# EAGLE design Organ (EAGLE 7.7.0)
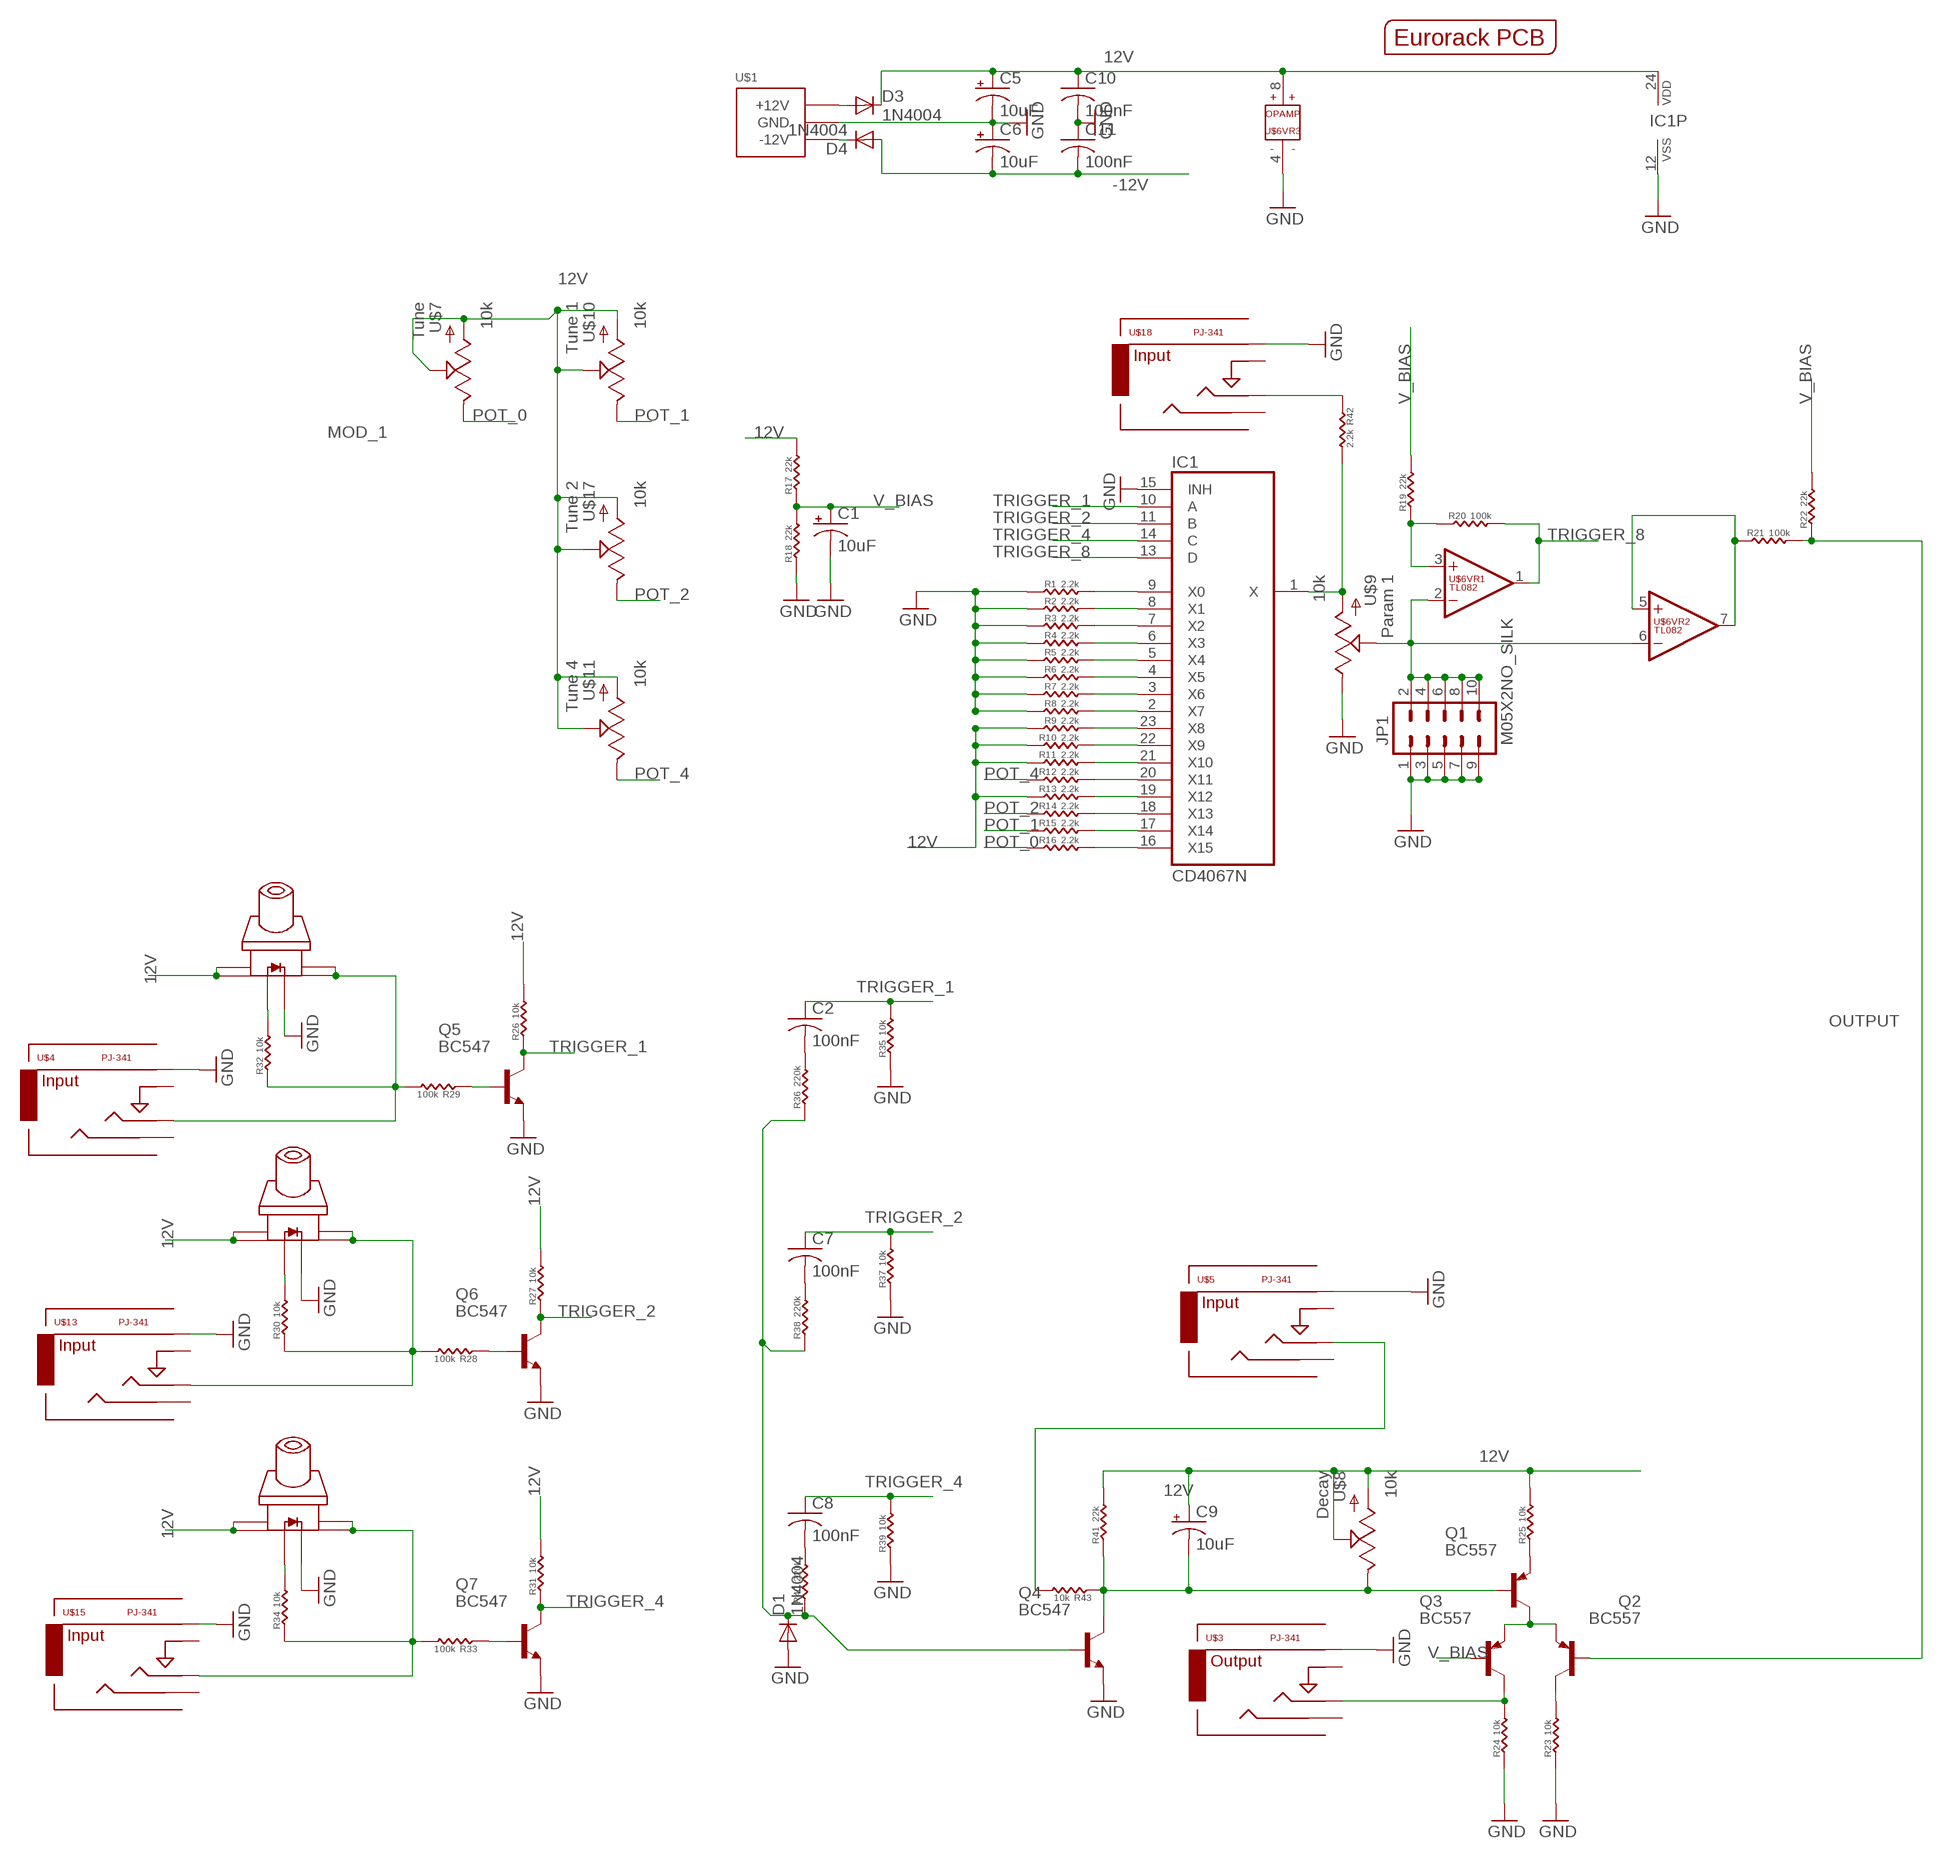
[diagram p0: schematic, sheet 1]

## Parts
C1  10uF  CPOL-USE5-6  [E5-6]
C2  100nF  C-US050-025X075  [C050-025X075]
C5  10uF  CPOL-USE5-6  [E5-6]
C6  10uF  CPOL-USE5-6  [E5-6]
C7  100nF  C-US050-025X075  [C050-025X075]
C8  100nF  C-US050-025X075  [C050-025X075]
C9  10uF  CPOL-USE5-6  [E5-6]
C10  100nF  C-US050-025X075  [C050-025X075]
C11  100nF  C-US050-025X075  [C050-025X075]
D1  1N4004  [DO41-10]
D3  1N4004  [DO41-10]
D4  1N4004  [DO41-10]
IC1  CD4067N  4067N  [DIL24-6]
JP1  M05X2NO_SILK  [2X5_NOSILK]
Q1  BC557  BC557TO92  [TO92]
Q2  BC557  BC557TO92  [TO92]
Q3  BC557  BC557TO92  [TO92]
Q4  BC547  [TO92]
Q5  BC547  [TO92]
Q6  BC547  [TO92]
Q7  BC547  [TO92]
R1  2.2k  R-US_0204/5  [0204/5]
R2  2.2k  R-US_0204/5  [0204/5]
R3  2.2k  R-US_0204/5  [0204/5]
R4  2.2k  R-US_0204/5  [0204/5]
R5  2.2k  R-US_0204/5  [0204/5]
R6  2.2k  R-US_0204/5  [0204/5]
R7  2.2k  R-US_0204/5  [0204/5]
R8  2.2k  R-US_0204/5  [0204/5]
R9  2.2k  R-US_0204/5  [0204/5]
R10  2.2k  R-US_0204/5  [0204/5]
R11  2.2k  R-US_0204/5  [0204/5]
R12  2.2k  R-US_0204/5  [0204/5]
R13  2.2k  R-US_0204/5  [0204/5]
R14  2.2k  R-US_0204/5  [0204/5]
R15  2.2k  R-US_0204/5  [0204/5]
R16  2.2k  R-US_0204/5  [0204/5]
R17  22k  R-US_0204/5  [0204/5]
R18  22k  R-US_0204/5  [0204/5]
R19  22k  R-US_0204/5  [0204/5]
R20  100k  R-US_0204/5  [0204/5]
R21  100k  R-US_0204/5  [0204/5]
R22  22k  R-US_0204/5  [0204/5]
R23  10k  R-US_0204/5  [0204/5]
R24  10k  R-US_0204/5  [0204/5]
R25  10k  R-US_0204/5  [0204/5]
R26  10k  R-US_0204/5  [0204/5]
R27  10k  R-US_0204/5  [0204/5]
R28  100k  R-US_0204/5  [0204/5]
R29  100k  R-US_0204/5  [0204/5]
R30  10k  R-US_0204/5  [0204/5]
R31  10k  R-US_0204/5  [0204/5]
R32  10k  R-US_0204/5  [0204/5]
R33  100k  R-US_0204/5  [0204/5]
R34  10k  R-US_0204/5  [0204/5]
R35  10k  R-US_0204/5  [0204/5]
R36  220k  R-US_0204/5  [0204/5]
R37  10k  R-US_0204/5  [0204/5]
R38  220k  R-US_0204/5  [0204/5]
R39  10k  R-US_0204/5  [0204/5]
R40  220k  R-US_0204/5  [0204/5]
R41  22k  R-US_0204/5  [0204/5]
R42  2.2k  R-US_0204/5  [0204/5]
R43  10k  R-US_0204/5  [0204/5]
U$1  POWER_SIMPLE10  [POWER_10]
U$2  EURORACK_PCB12HP  [EURORACK12HPPCB]
U$3  PJ-341  AUDIO-JACKOUTPUT  [3.5MM-JACK-SWITCH-13MM-OUTPUT]
U$4  PJ-341  AUDIO-JACKINPUT  [3.5MM-JACK-SWITCH-13MM-INPUT]
U$5  PJ-341  AUDIO-JACKINPUT  [3.5MM-JACK-SWITCH-13MM-INPUT]
U$6  TL082  TL072DIP  [DIL08]
U$7  10k  POTZEPHPOT  [OG-POTS_ALPS_POT_VERTICAL]
U$8  10k  POTZEPHPOT  [OG-POTS_ALPS_POT_VERTICAL]
U$9  10k  POTZEPHPOT  [OG-POTS_ALPS_POT_VERTICAL]
U$10  10k  POTZEPHPOT  [OG-POTS_ALPS_POT_VERTICAL]
U$11  10k  POTZEPHPOT  [OG-POTS_ALPS_POT_VERTICAL]
U$12  SWITCH_W_LED_PB6149L-X-102YELLOW  [PB6149L]
U$13  PJ-341  AUDIO-JACKINPUT  [3.5MM-JACK-SWITCH-13MM-INPUT]
U$14  SWITCH_W_LED_PB6149L-X-102YELLOW  [PB6149L]
U$15  PJ-341  AUDIO-JACKINPUT  [3.5MM-JACK-SWITCH-13MM-INPUT]
U$16  SWITCH_W_LED_PB6149L-X-102YELLOW  [PB6149L]
U$17  10k  POTZEPHPOT  [OG-POTS_ALPS_POT_VERTICAL]
U$18  PJ-341  AUDIO-JACKINPUT  [3.5MM-JACK-SWITCH-13MM-INPUT]

## Nets
12V: C5.+ C9.+ C10.1 D3.C IC1.24(VDD) R9.1 R10.1 R11.1 R13.1 R17.2 R25.2 R26.2 R27.2 R31.2 R41.2 U$6.8(VR3:V+) U$7.P$2(S) U$7.P$3(A) U$8.P$2(S) U$8.P$3(A) U$10.P$2(S) U$10.P$3(A) U$11.P$2(S) U$11.P$3(A) U$12.1 U$12.2 U$14.1 U$14.2 U$16.1 U$16.2 U$17.P$2(S) U$17.P$3(A)
-12V: C6.- C11.2 D4.A
GND: C1.- C5.- C6.+ C10.2 C11.1 D1.A IC1.12(VSS) IC1.15(INH) JP1.1 JP1.3 JP1.5 JP1.7 JP1.9 Q4.1(E) Q5.1(E) Q6.1(E) Q7.1(E) R1.1 R2.1 R3.1 R4.1 R5.1 R6.1 R7.1 R8.1 R18.1 R23.1 R24.1 R35.1 R37.1 R39.1 U$1.3(GND) U$1.4(GND) U$1.5(GND) U$1.6(GND) U$1.7(GND) U$1.8(GND) U$3.RING@3(RING) U$4.RING@3(RING) U$5.RING@3(RING) U$6.4(VR3:V-) U$9.P$1(E) U$12.LEDNEG(NEG) U$13.RING@3(RING) U$14.LEDNEG(NEG) U$15.RING@3(RING) U$16.LEDNEG(NEG) U$18.RING@3(RING)
MOD_1: IC1.1(X) R42.2 U$9.P$3(A)
N$1: IC1.9(X0) R1.2
N$2: IC1.8(X1) R2.2
N$3: IC1.7(X2) R3.2
N$4: IC1.6(X3) R4.2
N$5: IC1.5(X4) R5.2
N$6: IC1.4(X5) R6.2
N$7: IC1.3(X6) R7.2
N$8: IC1.2(X7) R8.2
N$9: IC1.23(X8) R9.2
N$10: IC1.22(X9) R10.2
N$11: IC1.21(X10) R11.2
N$12: IC1.20(X11) R12.2
N$13: IC1.19(X12) R13.2
N$14: IC1.18(X13) R14.2
N$15: IC1.17(X14) R15.2
N$16: IC1.16(X15) R16.2
N$17: D3.A U$1.9(+12V) U$1.10(+12V)
N$18: D4.C U$1.1(-12V) U$1.2(-12V)
N$19: R21.1 U$6.5(VR2:+IN) U$6.7(VR2:OUT)
N$20: JP1.2 JP1.4 JP1.6 JP1.8 JP1.10 U$6.2(VR1:-IN) U$6.6(VR2:-IN) U$9.P$2(S)
N$21: Q1.3(C) Q2.1(E) Q3.1(E)
N$22: R19.1 R20.1 U$6.3(VR1:+IN)
N$23: R42.1 U$18.TIP@3(TIP)
N$24: Q2.3(C) R23.2
N$25: Q3.3(C) R24.2 U$3.TIP@3(TIP)
N$26: R43.2 U$5.TIP@3(TIP)
N$27: Q1.1(E) R25.1
N$44: C2.2 R36.2
N$45: C9.- Q1.2(B) Q4.3(C) R41.1 R43.1 U$8.P$1(E)
N$46: Q6.2(B) R28.1
N$47: Q5.2(B) R29.1
N$48: R28.2 R30.1 U$13.TIP@3(TIP) U$14.3 U$14.4
N$49: R30.2 U$14.LEDPOS(POS)
N$50: R29.2 R32.1 U$4.TIP@3(TIP) U$12.3 U$12.4
N$51: R32.2 U$12.LEDPOS(POS)
N$52: D1.C Q4.2(B) R36.1 R38.1 R40.1
N$53: Q7.2(B) R33.1
N$54: R33.2 R34.1 U$15.TIP@3(TIP) U$16.3 U$16.4
N$55: R34.2 U$16.LEDPOS(POS)
N$56: C7.2 R38.2
N$59: C8.2 R40.2
OUTPUT: Q2.2(B) R21.2 R22.1
POT_0: R16.1 U$7.P$1(E)
POT_1: R15.1 U$10.P$1(E)
POT_2: R14.1 U$17.P$1(E)
POT_4: R12.1 U$11.P$1(E)
TRIGGER_1: C2.1 IC1.10(A) Q5.3(C) R26.1 R35.2
TRIGGER_2: C7.1 IC1.11(B) Q6.3(C) R27.1 R37.2
TRIGGER_4: C8.1 IC1.14(C) Q7.3(C) R31.1 R39.2
TRIGGER_8: IC1.13(D) R20.2 U$6.1(VR1:OUT)
V_BIAS: C1.+ Q3.2(B) R17.1 R18.2 R19.2 R22.2
Unconnected: U$3.SECOND@3(SECOND) U$3.SWITCH@3(SWITCH) U$4.SECOND@3(SECOND) U$4.SWITCH@3(SWITCH) U$5.SECOND@3(SECOND) U$5.SWITCH@3(SWITCH) U$13.SECOND@3(SECOND) U$13.SWITCH@3(SWITCH) U$15.SECOND@3(SECOND) U$15.SWITCH@3(SWITCH) U$18.SECOND@3(SECOND) U$18.SWITCH@3(SWITCH)

## Library data of the parts
C1 C5 C6 C9 = LompeOnderdelen:CPOL-US: POLARIZED CAPACITOR, American symbol
C2 C7 C8 C10 C11 = LompeOnderdelen:C-US: CAPACITOR, American symbol
D1 D3 D4 = adafruit:1N4004: DIODE General purpose 1N400x type rectifier (With bigger pads) http://www.ladyada.net/library/pcb/eaglelibrary.html
IC1 = LompeOnderdelen:4067: 16-channel ANALOG MULTIPLEXER
JP1 = SparkFun-Connectors:M05X2: Header 5x2 Standard 10-pin dual row 0.1" header. Commonly used with AVR-ISP. Use with Spark Fun Electronics SKU: PRT-00778
Q1-Q3 = LompeOnderdelen:BC557*: PNP Transistror
Q4-Q7 = LompeOnderdelen:BC547*: NPN Transistor
R1-R43 = LompeOnderdelen:R-US_: RESISTOR, American symbol
U$1 = EurorackModularParts:POWER_SIMPLE
U$2 = EurorackModularParts:EURORACK_PCB
U$3 = EurorackModularParts:AUDIO-JACK: Switching Mono 3.5mm Audio Jack from Erthenvar.; DESC: Output; MPN: PJ-341
U$4 U$5 U$13 U$15 U$18 = EurorackModularParts:AUDIO-JACK: Switching Mono 3.5mm Audio Jack from Erthenvar.; DESC: Input; MPN: PJ-341
U$6 = LompeOnderdelen:TL072
U$7 = EurorackModularParts:POT; DESC: Tune
U$8 = EurorackModularParts:POT; DESC: Decay
U$9 = EurorackModularParts:POT; DESC: Param 1
U$10 = EurorackModularParts:POT; DESC: Tune 1
U$11 = EurorackModularParts:POT; DESC: Tune 4
U$12 U$14 U$16 = zephod-components:SWITCH_W_LED_PB6149L-X-102
U$17 = EurorackModularParts:POT; DESC: Tune 2

## Net classes
0 default: width 0.406 mm, clearance 0.178 mm
3 groundplane: width 0.203 mm, clearance 0.203 mm

## Board
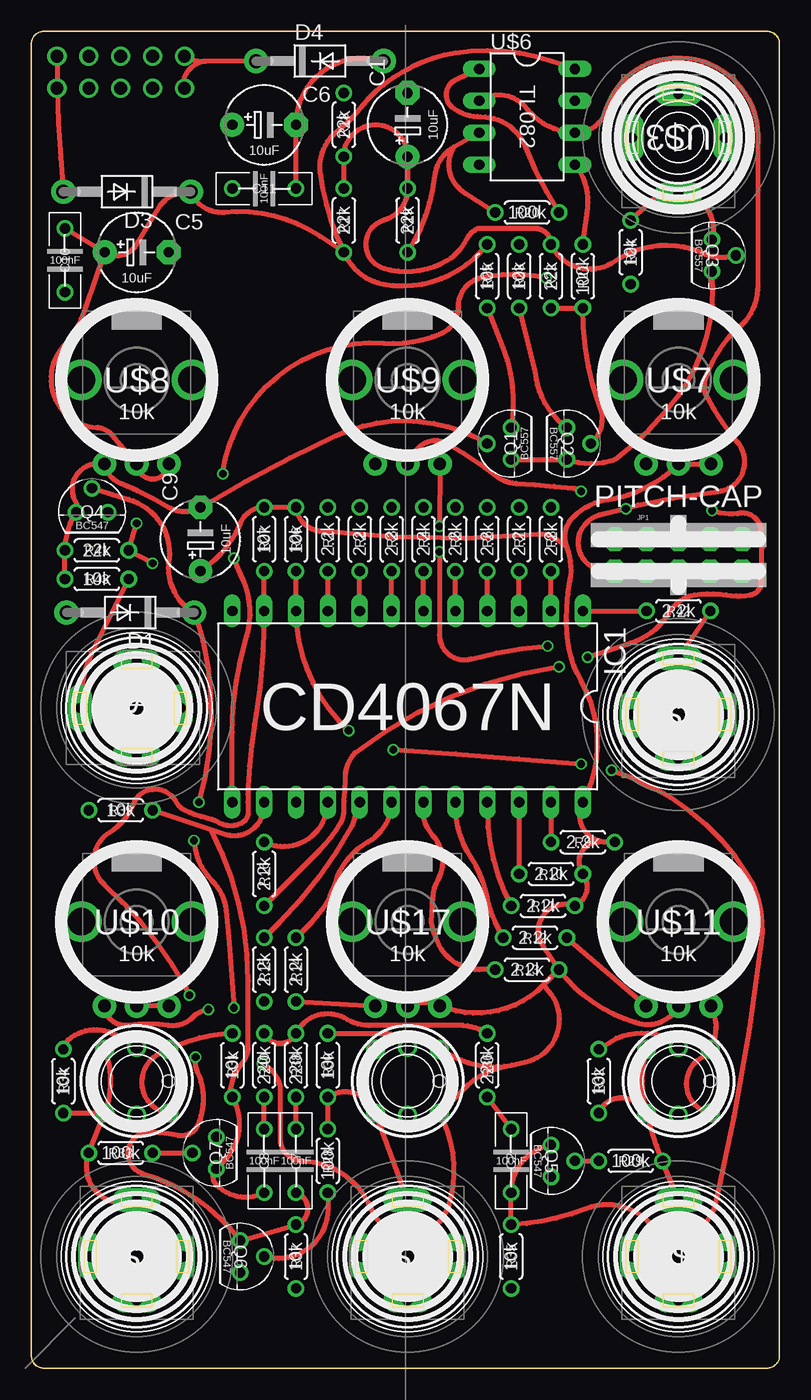
[diagram p1: board, top side]
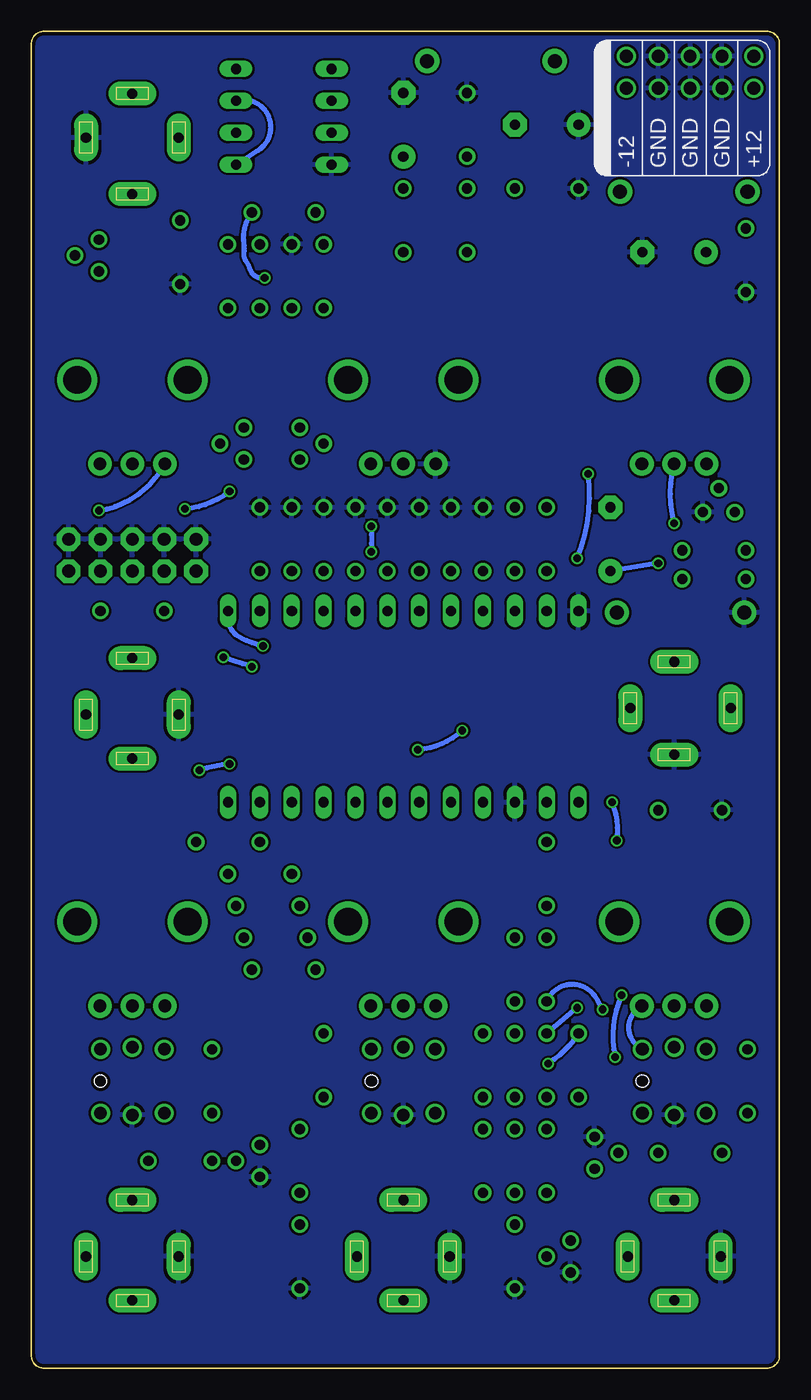
[diagram p2: board, bottom side, seen from below]

Size 59.62 x 106.5 mm. Coordinates in mm from the lower left corner, seen from the top.
Copper layers (1*16): Top 0.035mm / dielectric 1.5mm / Bottom 0.035mm
Design rules "ITEADstudio_DRC": minimum track width 6mil, minimum drill 12mil, track to track 6mil, track to pad 6mil, pad to pad 6mil, via to via 6mil, smd to smd 0mil, copper to edge 10mil, drill to drill 10mil, minimum pad ring 10mil, minimum via ring 6mil, stop-mask expansion 2mil, vias tented up to drill 100mil, thermal gap 10mil

### Footprints (pad centres in the part's own frame; a part is rotated, then mirrored left to right if it is on the bottom)
E5-6 = drill 0.813 pad 1.905: + -2.54,0 | drill 0.813 pad 1.905 octagon: - 2.54,0
C050-025X075 = drill 0.813: 1 -2.54,0; 2 2.54,0
DO41-10 = drill 1.118 pad 1.93: A 5.08,0; C -5.08,0
DIL24-6 = drill 0.813 long: 1 -13.97,-7.62; 2 -11.43,-7.62; 3 -8.89,-7.62; 4 -6.35,-7.62; 5 -3.81,-7.62; 6 -1.27,-7.62; 7 1.27,-7.62; 8 3.81,-7.62; 9 6.35,-7.62; 10 8.89,-7.62; 11 11.43,-7.62; 12 13.97,-7.62; 13 13.97,7.62; 14 11.43,7.62; 15 8.89,7.62; 16 6.35,7.62; 17 3.81,7.62; 18 1.27,7.62; 19 -1.27,7.62; 20 -3.81,7.62; 21 -6.35,7.62; 22 -8.89,7.62; 23 -11.43,7.62; 24 -13.97,7.62
2X5_NOSILK = drill 1.016 pad 1.88 octagon: 1 -1.27,5.08; 2 1.27,5.08; 3 -1.27,2.54; 4 1.27,2.54; 5 -1.27,0; 6 1.27,0; 7 -1.27,-2.54; 8 1.27,-2.54; 9 -1.27,-5.08; 10 1.27,-5.08
TO92 = drill 0.813: 1 1.27,0; 2 0,1.905; 3 -1.27,0
0204/5 = drill 0.813: 1 -2.54,0; 2 2.54,0
POWER_10 = drill 1.016: 1 -5.08,-1.27; 2 -5.08,1.27; 3 -2.54,-1.27; 4 -2.54,1.27; 5 0,-1.27; 6 0,1.27; 7 2.54,-1.27; 8 2.54,1.27; 9 5.08,-1.27; 10 5.08,1.27
3.5MM-JACK-SWITCH-13MM-OUTPUT = drill 0.8 pad 1.93 long: RING@3 -3.7,0; SECOND@3 0,-3.5; SWITCH@3 3.7,0; TIP@3 0,4.5
3.5MM-JACK-SWITCH-13MM-INPUT = drill 0.8 pad 1.93 long: RING@3 -3.7,0; SECOND@3 0,-3.5; SWITCH@3 3.7,0; TIP@3 0,4.5
DIL08 = drill 0.813 long: 1 -3.81,-3.81; 2 -1.27,-3.81; 3 1.27,-3.81; 4 3.81,-3.81; 5 3.81,3.81; 6 1.27,3.81; 7 -1.27,3.81; 8 -3.81,3.81
OG-POTS_ALPS_POT_VERTICAL = drill 1 pad 1.88: P$1 -2.58,-6.7; P$2 0,-6.7; P$3 2.58,-6.7 | drill 2.2 pad 3.175: P$4 4.4,0; P$5 -4.4,0
PB6149L = drill 1: 1 2.54,2.54; 2 2.54,-2.54; 3 -2.54,2.54; 4 -2.54,-2.54; LEDNEG 0,-2.7; LEDPOS 0,2.7 | hole 1: 2.54,0

### Placement (x,y rotation side)
C1  29.98,99.06 90 top
C2  38.23,16.51 90 top
C5  8.39,88.9 0 top
C6  18.55,99.06 0 top
C7  21.09,16.51 90 top
C8  18.55,16.51 90 top
C9  13.47,66.04 90 top
C10  2.67,88.27 270 top
C11  18.55,93.98 0 top
D1  7.88,60.2 180 top
D3  7.63,93.73 180 top
D4  23,104.14 0 top
IC1  29.98,52.7 180 top
JP1  51.57,64.77 270 top
Q1  38.23,73.66 90 top
Q2  42.68,73.66 270 top
Q3  54.24,88.65 270 top
Q4  4.83,68.2 0 top
Q5  41.41,16.51 270 top
Q6  16.64,8.89 270 top
Q7  14.74,17.14 90 top
R1  23.63,66.04 270 top
R2  26.17,66.04 270 top
R3  28.71,66.04 270 top
R4  31.25,66.04 270 top
R5  33.79,66.04 270 top
R6  36.33,66.04 270 top
R7  38.87,66.04 270 top
R8  41.41,66.04 270 top
R9  43.95,41.91 180 top
R10  41.41,39.37 180 top
R11  40.77,36.83 180 top
R12  40.14,34.29 180 top
R13  39.51,31.75 180 top
R14  21.09,31.75 90 top
R15  18.55,31.75 90 top
R16  18.55,39.37 90 top
R17  24.9,91.44 270 top
R18  24.9,99.06 270 top
R19  29.98,91.44 90 top
R20  39.51,92.08 0 top
R21  43.95,87 270 top
R22  41.41,87 90 top
R23  38.87,87 270 top
R24  47.76,88.9 90 top
R25  36.33,87 90 top
R26  21.09,66.04 90 top
R27  18.55,66.04 90 top
R28  23.63,16.51 90 top
R29  47.76,16.51 0 top
R30  23.63,24.13 90 top
R31  16.01,24.13 90 top
R32  45.22,22.86 90 top
R33  7.12,17.14 180 top
R34  2.55,22.86 90 top
R35  38.23,8.89 90 top
R36  36.33,24.13 270 top
R37  21.09,8.89 90 top
R38  21.09,24.13 270 top
R39  7.12,44.45 0 top
R40  18.55,24.13 270 top
R41  5.21,65.15 0 top
R42  51.57,60.33 180 top
R43  5.21,62.87 0 top
U$1  7.12,103.25 0 bottom
U$2  -0.5,0 0 top
U$3  51.57,98.04 180 top
U$4  51.57,8.89 0 top
U$5  8.39,52.58 90 top
U$6  39.51,99.69 270 top
U$7  51.57,78.74 0 top
U$8  8.39,78.74 0 top
U$9  29.98,78.74 0 top
U$10  8.39,35.56 0 top
U$11  51.57,35.56 0 top
U$12  51.57,22.86 0 top
U$13  29.98,8.89 0 top
U$14  29.98,22.86 0 top
U$15  8.39,8.89 0 top
U$16  8.39,22.86 0 top
U$17  29.98,35.56 0 top
U$18  51.57,52.07 0 top

### Tracks (layer width: path | path; a pad name or v marks a point on that pad's centre or on a via)
12V  (via drill 0.61)
  Top 0.406: R17.2 arc57 28.07,86.36 arc62 R25.2 | C10.1 C5.+ | C5.+ arc90 8.39,89.53 10.29,92.71 arc-51 D3.C arc73 15.38,92.08 arc-39 23,90.17 R17.2 | U$8.P$3 arc-172 U$8.P$2 6.49,74.3 arc46 5.21,74.93 arc-128 2.55,81.41 arc22 4.2,84.2 C5.+ | R9.1 45.85,41.91 | 45.85,41.91 arc-118 IC1.24 arc58 43.82,54.74 arc-26 42.68,58.55 arc-15 42.93,62.74 arc32 42.68,65.41 | C9.+ arc34 16.64,67.31 arc-67 R27.2 R26.2 arc77 23,66.67 arc12 40.39,66.42 arc-41 41.79,66.04 42.68,65.41 | R13.1 40.77,33.66 arc-145 R11.1 arc102 R10.1 arc-127 45.22,41.91 45.85,41.91 | R13.1 arc37 48.14,27.56 arc83 U$11.P$2 arc-128 U$11.P$3 arc-54 U$12.1 arc-35 53.48,24.77 arc141 U$12.2 | R13.1 40.77,30.48 | 40.77,30.48 arc-68 U$17.P$3 arc45 U$17.P$2 | 38.23,24.13 arc37 34.42,22.23 U$14.2 arc-46 33.28,12.95 arc-141 27.06,12.7 arc67 21.6,16.51 arc-90 19.82,18.29 19.82,22.48 arc51 v18.42,24.26 | U$14.1 33.79,24.77 arc37 38.23,24.13 | U$6.8 41.41,104.14 arc27 33.79,104.78 arc30 28.07,102.23 arc12 26.17,100.33 arc-12 24.27,98.42 arc58 23,95.25 arc19 R17.2 | U$7.P$3 U$7.P$2 arc-37 45.98,69.22 arc36 43.19,67.82 arc67 42.68,65.41 | U$16.2 arc-145 10.17,25.02 U$16.1 arc-25 R31.2 | U$10.P$3 U$10.P$2 | 38.23,24.13 39.38,24.38 arc129 40.77,30.48 | v8.39,67.31 R41.2 v9.66,64.14
  Bottom 0.406: U$16.1 arc126 U$10.P$3 | R31.2 16.39,26.16 arc20 v18.42,24.26 | v8.39,67.31 arc28 U$8.P$2 | v9.66,64.14 C9.+
-12V
  Top 0.406: C11.2 C6.- arc-108 D4.A
GND
  pour Bottom: 0.14,106.68 59.83,106.68 59.83,0 0.14,0
MOD_1  (via drill 0.61)
  Top 0.406: IC1.1 R42.2 | U$9.P$3 v32.52,67.06 | v32.52,65.02 arc-1 32.52,58.42 arc107 35.06,56.52 arc-11 v41.16,57.53
  Bottom 0.406: v32.52,67.06 arc1 v32.52,65.02 | v41.16,57.53 arc20 43.31,58.42 arc61 IC1.1
N$1
  Top 0.406: IC1.9 R1.2
N$2
  Top 0.406: IC1.8 R2.2
N$3
  Top 0.406: IC1.7 R3.2
N$4
  Top 0.406: IC1.6 R4.2
N$5
  Top 0.406: IC1.5 R5.2
N$6
  Top 0.406: IC1.4 R6.2
N$7
  Top 0.406: IC1.3 R7.2
N$8
  Top 0.406: IC1.2 R8.2
N$9
  Top 0.406: IC1.23 R9.2
N$10
  Top 0.406: IC1.22 R10.2
N$11
  Top 0.406: IC1.21 36.33,44.45 arc28 R11.2
N$12
  Top 0.406: R12.2 36.97,35.56 arc-16 36.33,37.47 arc23 35.06,40.64 arc-35 IC1.20
N$13
  Top 0.406: R13.2 35.7,31.75 arc-62 32.52,33.66 arc-19 31.88,35.56 32.01,37.59 arc-26 32.39,38.86 arc72 32.01,42.42 arc-52 IC1.19
N$14
  Top 0.406: R14.2 22.36,35.56 arc28 24.27,38.73 arc-43 26.8,41.91 arc68 28.71,45.72 IC1.18
N$15
  Top 0.406: IC1.17 25.54,43.18 arc-16 19.82,35.56 R15.2
N$16
  Top 0.406: R16.2 arc115 IC1.16
N$17
  Top 0.406: U$1.10 U$1.9 arc3 D3.A
N$18
  Top 0.406: 14.11,104.14 arc-45 U$1.2 | D4.C 14.11,104.14 | 14.11,104.14 arc67 12.2,102.87 U$1.1
N$19
  Top 0.406: R21.1 44.33,92.46 arc48 U$6.5
  Bottom 0.406: U$6.5 41.54,97.03 arc-163 U$6.7
N$20  (via drill 0.61)
  Top 0.406: JP1.2 JP1.4 JP1.6 JP1.8 JP1.10 45.85,63.5 arc-164 45.22,67.94 | 45.22,67.94 arc-10 54.74,69.85 arc61 56.65,71.25 arc64 56.27,73.79 arc-12 53.86,77.34 arc-47 53.73,78.87 arc-30 56.52,83.06 arc37 57.79,85.22 arc14 57.92,86.61 57.92,98.17 arc100 50.55,104.27 arc67 45.85,100.33 arc-76 U$6.6 arc-51 39.51,100.33 arc85 U$6.2 | U$9.P$2 30.61,73.03 arc-86 33.16,73.66 arc-9 36.97,71.12 arc34 38.62,70.48 arc-2 43.19,70.1 arc-32 v43.82,69.85 | v47.38,68.45 45.22,67.94
  Bottom 0.406: v43.82,69.85 arc33 v47.38,68.45
N$21
  Top 0.406: Q1.3 Q2.1 arc37 46.49,72.39 arc16 51.57,77.47 arc42 Q3.1
N$22
  Top 0.406: U$6.3 33.66,97.28 | 33.66,97.28 arc54 32.14,95 arc-26 R19.1 | R20.1 34.55,93.6 arc-88 33.66,97.28
N$23
  Top 0.406: R42.1 U$18.TIP@3
N$24
  Top 0.406: R23.2 40.14,79.38 arc49 Q2.3
N$25
  Top 0.406: R24.2 49.03,92.71 arc-54 U$3.TIP@3 arc-105 Q3.3
N$26
  Top 0.406: R43.2 5.21,57.78 arc31 U$5.TIP@3
N$27
  Top 0.406: R25.1 37.6,81.28 arc-29 Q1.1
N$44
  Top 0.406: R36.2 C2.2
N$45
  Top 0.406: Q1.2 arc55 24.27,74.3 arc6 C9.- arc-62 10.93,68.58 arc9 7.12,70.48 arc-55 U$8.P$1 arc134 3.56,68.96 arc-62 Q4.3 arc29 R41.1 R43.1
N$46
  Top 0.406: R28.1 23.63,12.7 arc-106 Q6.2
N$47
  Top 0.406: Q5.2 R29.1
N$48
  Top 0.406: R28.2 R30.1 arc-103 U$14.4 | U$13.TIP@3 U$14.4 | U$14.4 26.8,21.59 arc-72 U$14.3
N$49
  Top 0.406: R30.2 28.07,26.67 arc-60 U$14.LEDPOS
N$50
  Top 0.406: U$4.TIP@3 R29.2 arc-7 U$12.4 | U$12.4 arc-29 U$12.3 | U$12.4 48.4,20.95 arc113 R32.1
N$51
  Top 0.406: U$12.LEDPOS 51.57,25.91 arc53 46.62,26.29 R32.2
N$52  (via drill 0.61)
  Top 0.406: R40.1 arc128 R38.1 arc-91 24.9,27.94 arc35 26.93,27.3 34.42,27.3 arc-30 R36.1 | v13.34,45.09 arc34 13.09,59.94 arc75 D1.C arc-66 10.93,64.14 arc44 10.29,67.31 arc40 7.76,69.22 Q4.2 | v12.96,42.04 arc39 14.36,38.86 arc-42 15.5,36.45 arc-3 v16.14,28.7
  Bottom 0.406: v13.34,45.09 arc27 v12.96,42.04 | v16.14,28.7 R40.1
N$53
  Top 0.406: R33.1 Q7.2
N$54
  Top 0.406: U$16.4 R33.2 arc134 U$15.TIP@3 | U$16.4 arc44 U$16.3 | R34.1 U$16.4
N$55
  Top 0.406: R34.2 2.93,26.16 arc-70 6.74,26.54 arc-3 U$16.LEDPOS
N$56
  Top 0.406: C7.2 R38.2
N$59
  Top 0.406: C8.2 R40.2
OUTPUT
  Top 0.406: R22.1 R21.2 arc20 45.22,76.83 arc-76 Q2.2
POT_0  (via drill 0.61)
  Top 0.406: R16.1 23,41.27 arc15 24.65,43.43 arc28 24.9,44.32 arc-2 25.03,46.86 arc-46 25.79,49.02 arc-30 v42.05,55.88 | v54.24,68.33 arc26 56.27,68.07 arc-104 58.17,66.67 arc-6 58.17,62.61 arc-80 57.28,61.59 arc-18 55.38,61.59 arc18 52.84,61.59 arc49 50.94,60.33 arc-43 47.76,57.78 v44.33,56.64
  Bottom 0.406: v42.05,55.88 arc1 v44.33,56.64 | v54.24,68.33 arc-53 U$7.P$1
POT_1  (via drill 0.61)
  Top 0.406: v14.11,28.57 arc37 12.84,27.94 arc-53 10.93,27.3 arc16 7.76,27.3 arc-94 U$10.P$1
  Bottom 0.406: v14.11,28.57 14.61,29.46 arc-128 R15.1
POT_2
  Top 0.406: R14.1 U$17.P$1
POT_4
  Top 0.406: R12.1 U$11.P$1
TRIGGER_1  (via drill 0.61)
  Top 0.406: R26.1 IC1.10 arc47 v25.28,50.8 | Q5.3 arc80 C2.1 R35.2 arc18 44.2,12.7 arc-70 49.41,11.43 arc68 52.33,10.67 arc58 54.49,13.08 arc6 58.17,34.04 arc38 57.03,39.37 arc41 v46.24,47.62 | v28.84,49.28 arc-1 v43.82,48.13
  Bottom 0.406: v25.28,50.8 arc39 v28.84,49.28 | v43.82,48.13 arc-13 v46.24,47.62
TRIGGER_2  (via drill 0.61)
  Top 0.406: R27.1 IC1.11 arc-10 17.79,51.31 arc8 17.28,46.35 arc4 17.28,44.45 arc-68 16.77,43.43 arc-57 14.99,43.43 arc21 13.98,43.81 arc-14 12.2,44.45 arc-36 11.56,45.09 arc68 9.66,46.1 arc64 8.14,44.96 arc-37 6.23,42.67 arc107 5.85,38.48 arc-19 12.2,30.48 arc-4 v12.58,29.72 | C7.1 arc-148 R37.2 Q6.3 arc36 8.9,15.49 arc-165 9.41,18.8 arc-10 11.69,18.54 arc76 13.22,19.3 arc51 13.22,23.62 arc-38 v13.09,24.77
  Bottom 0.406: v12.58,29.72 arc-37 v13.09,24.77
TRIGGER_4
  Top 0.406: R39.2 14.31,42.9 | 14.31,42.9 15.38,42.55 arc114 IC1.14 | C8.1 arc-71 14.74,14.61 arc-90 Q7.3 15.38,16.51 arc76 R31.1 arc-39 15.88,22.23 arc-31 16.77,24.26 arc30 17.28,25.4 17.28,30.86 arc28 14.31,42.9
TRIGGER_8  (via drill 0.61)
  Top 0.406: U$6.1 33.79,102.62 arc117 33.54,100.46 arc17 34.42,99.95 arc21 35.82,99.69 arc-69 39.38,97.28 arc12 R20.2 | IC1.13 16.01,50.67 arc-17 17.15,58.29 arc41 16.9,62.74 arc-1 v16.14,64.52 | v15.25,71.25 arc-86 28.07,81.66 arc27 32.65,82.42 arc68 34.04,84.58 arc-78 35.82,86.87 arc-26 v41.03,86.87
  Bottom 0.406: v16.14,64.52 arc-31 v15.25,71.25 | v41.03,86.87 arc84 42.17,87.5 arc-16 42.55,88.27 arc41 42.68,88.77 arc-13 42.68,89.66 arc42 R20.2
V_BIAS
  Top 0.406: R17.1 R18.2 arc-180 C1.+ R19.2 arc-74 28.07,91.44 arc147 28.07,87.63 arc47 33.16,88.27 arc34 34.68,89.92 arc-38 35.57,90.81 40.14,90.81 arc-90 R22.2 arc96 46.24,88.01 arc-58 53.35,88.9 arc41 Q3.2

### Text on the board
tPlace: PITCH-CAP